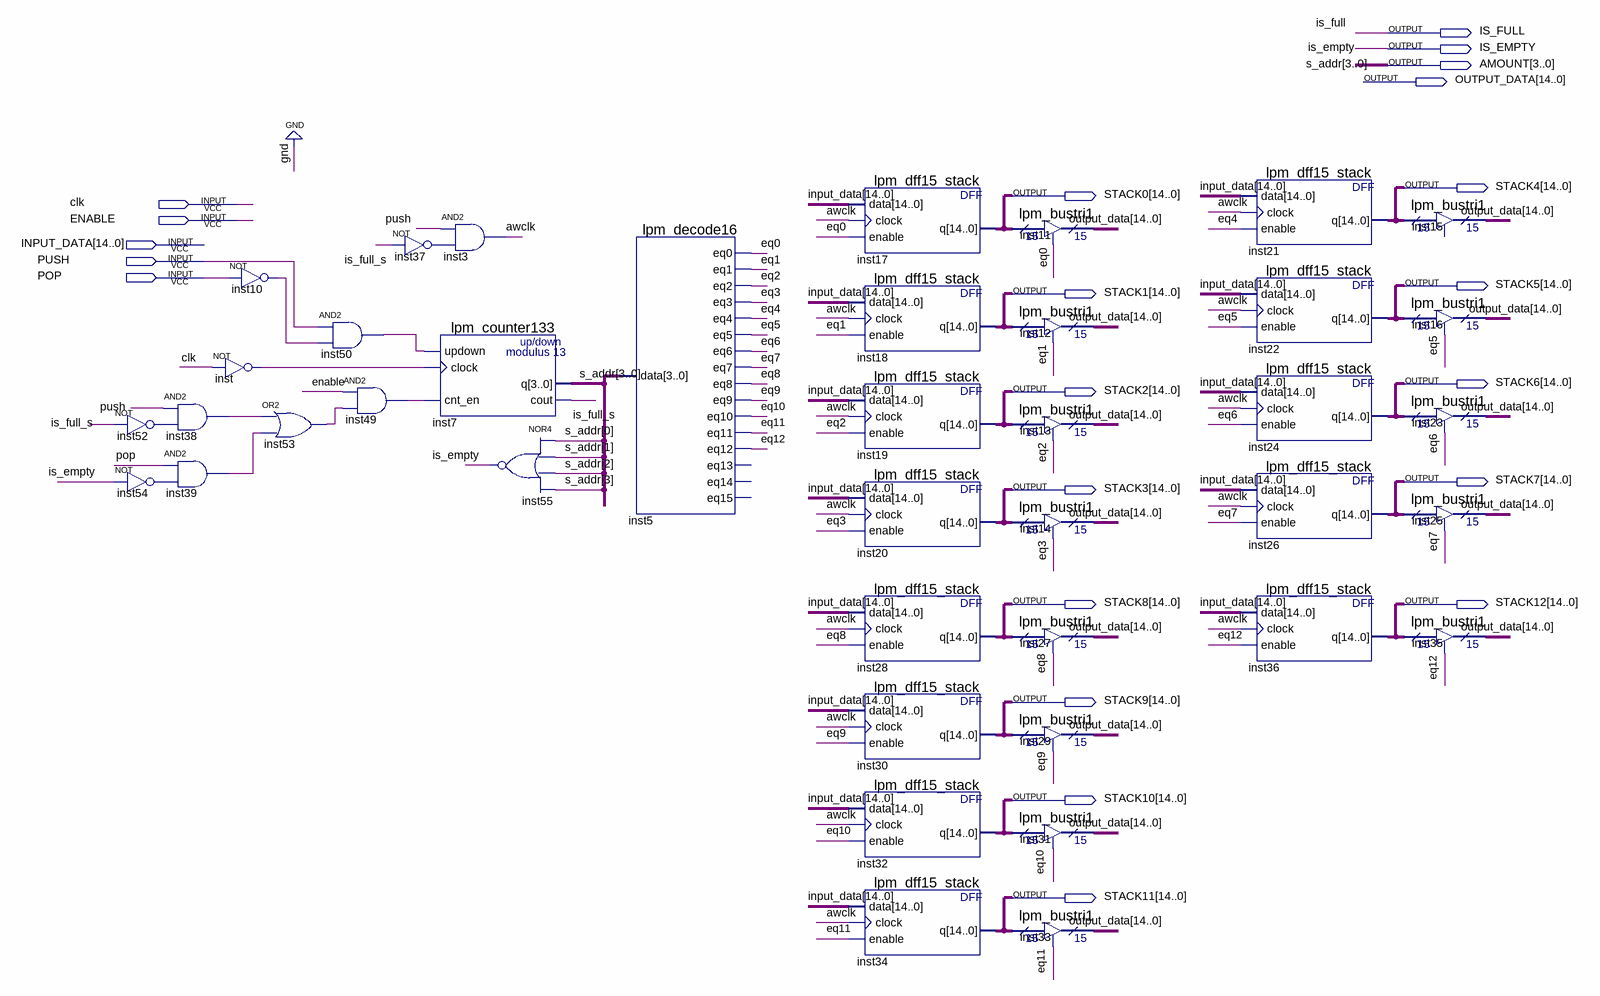
[diagram p0: schematic sheet]
// Quartus schematic STACK.bdf as structural Verilog: 40 symbols, 22 pins
module STACK (
  input  clk,
  input  ENABLE,
  input  [14:0] INPUT_DATA,
  input  PUSH,
  input  POP,
  output IS_FULL,
  output IS_EMPTY,
  output [3:0] AMOUNT,
  output [14:0] OUTPUT_DATA,
  output [14:0] STACK4,
  output [14:0] STACK0,
  output [14:0] STACK5,
  output [14:0] STACK1,
  output [14:0] STACK6,
  output [14:0] STACK2,
  output [14:0] STACK7,
  output [14:0] STACK3,
  output [14:0] STACK8,
  output [14:0] STACK12,
  output [14:0] STACK9,
  output [14:0] STACK10,
  output [14:0] STACK11
);

  wire awclk, eq0, eq1, eq2, eq3, eq4, eq5, eq6, eq7, eq8, eq9, eq10, eq11, eq12, inst10_out, inst37_out,
       inst38_out, inst39_out, inst49_out, inst50_out, inst52_out, inst53_out, inst54_out, inst_out,
       is_full_s;

  not inst52 (inst52_out, is_full_s);
  not inst54 (inst54_out, IS_EMPTY);
  not inst (inst_out, clk);
  and inst38 (inst38_out, PUSH, inst52_out);
  and inst39 (inst39_out, POP, inst54_out);
  not inst10 (inst10_out, POP);
  or inst53 (inst53_out, inst38_out, inst39_out);
  and inst50 (inst50_out, PUSH, inst10_out);
  and inst49 (inst49_out, ENABLE, inst53_out);
  not inst37 (inst37_out, is_full_s);
  and inst3 (awclk, PUSH, inst37_out);
  lpm_counter133 inst7 (.updown(inst50_out), .clock(inst_out), .cnt_en(inst49_out), .q(AMOUNT), .cout(is_full_s));
  nor inst55 (IS_EMPTY, AMOUNT[0], AMOUNT[1], AMOUNT[2], AMOUNT[3]);
  lpm_decode16 inst5 (
    .data(AMOUNT), .eq0(eq0), .eq1(eq1), .eq2(eq2), .eq3(eq3), .eq4(eq4), .eq5(eq5), .eq6(eq6), .eq7(eq7),
    .eq8(eq8), .eq9(eq9), .eq10(eq10), .eq11(eq11), .eq12(eq12));  // open: eq13, eq14, eq15
  lpm_dff15_stack inst17 (.data(INPUT_DATA), .clock(awclk), .enable(eq0), .q(STACK0));
  lpm_dff15_stack inst18 (.data(INPUT_DATA), .clock(awclk), .enable(eq1), .q(STACK1));
  lpm_dff15_stack inst19 (.data(INPUT_DATA), .clock(awclk), .enable(eq2), .q(STACK2));
  lpm_dff15_stack inst20 (.data(INPUT_DATA), .clock(awclk), .enable(eq3), .q(STACK3));
  lpm_dff15_stack inst28 (.data(INPUT_DATA), .clock(awclk), .enable(eq8), .q(STACK8));
  lpm_dff15_stack inst30 (.data(INPUT_DATA), .clock(awclk), .enable(eq9), .q(STACK9));
  lpm_dff15_stack inst32 (.data(INPUT_DATA), .clock(awclk), .enable(eq10), .q(STACK10));
  lpm_dff15_stack inst34 (.data(INPUT_DATA), .clock(awclk), .enable(eq11), .q(STACK11));
  lpm_bustri1 inst11 (.enabledt(eq0), .data(STACK0), .tridata(OUTPUT_DATA));
  lpm_bustri1 inst12 (.enabledt(eq1), .data(STACK1), .tridata(OUTPUT_DATA));
  lpm_bustri1 inst13 (.enabledt(eq2), .data(STACK2), .tridata(OUTPUT_DATA));
  lpm_bustri1 inst14 (.enabledt(eq3), .data(STACK3), .tridata(OUTPUT_DATA));
  lpm_bustri1 inst27 (.enabledt(eq8), .data(STACK8), .tridata(OUTPUT_DATA));
  lpm_bustri1 inst29 (.enabledt(eq9), .data(STACK9), .tridata(OUTPUT_DATA));
  lpm_bustri1 inst31 (.enabledt(eq10), .data(STACK10), .tridata(OUTPUT_DATA));
  lpm_bustri1 inst33 (.enabledt(eq11), .data(STACK11), .tridata(OUTPUT_DATA));
  lpm_dff15_stack inst21 (.data(INPUT_DATA), .clock(awclk), .enable(eq4), .q(STACK4));
  lpm_dff15_stack inst22 (.data(INPUT_DATA), .clock(awclk), .enable(eq5), .q(STACK5));
  lpm_dff15_stack inst24 (.data(INPUT_DATA), .clock(awclk), .enable(eq6), .q(STACK6));
  lpm_dff15_stack inst26 (.data(INPUT_DATA), .clock(awclk), .enable(eq7), .q(STACK7));
  lpm_dff15_stack inst36 (.data(INPUT_DATA), .clock(awclk), .enable(eq12), .q(STACK12));
  lpm_bustri1 inst15 (.data(STACK4), .tridata(OUTPUT_DATA));  // open: enabledt
  lpm_bustri1 inst16 (.enabledt(eq5), .data(STACK5), .tridata(OUTPUT_DATA));
  lpm_bustri1 inst23 (.enabledt(eq6), .data(STACK6), .tridata(OUTPUT_DATA));
  lpm_bustri1 inst25 (.enabledt(eq7), .data(STACK7), .tridata(OUTPUT_DATA));
  lpm_bustri1 inst35 (.enabledt(eq12), .data(STACK12), .tridata(OUTPUT_DATA));

  // Other names for the same wires on the sheet: s_addr[3:0] = AMOUNT
endmodule
